# EasyEDA Pro project ProPrj_Buck_明月班_2025_2026-01-13.epro

# Schematic Schematic1
Board Name: Board1; Create Date: 2025-11-12; Page Name: P1; Project Name: Buck_明月班_2025; Schematic Name: Schematic1; Update Date: 2025-11-12; Company: 嘉立创EDA; Page Size: A3; Version: V1.0
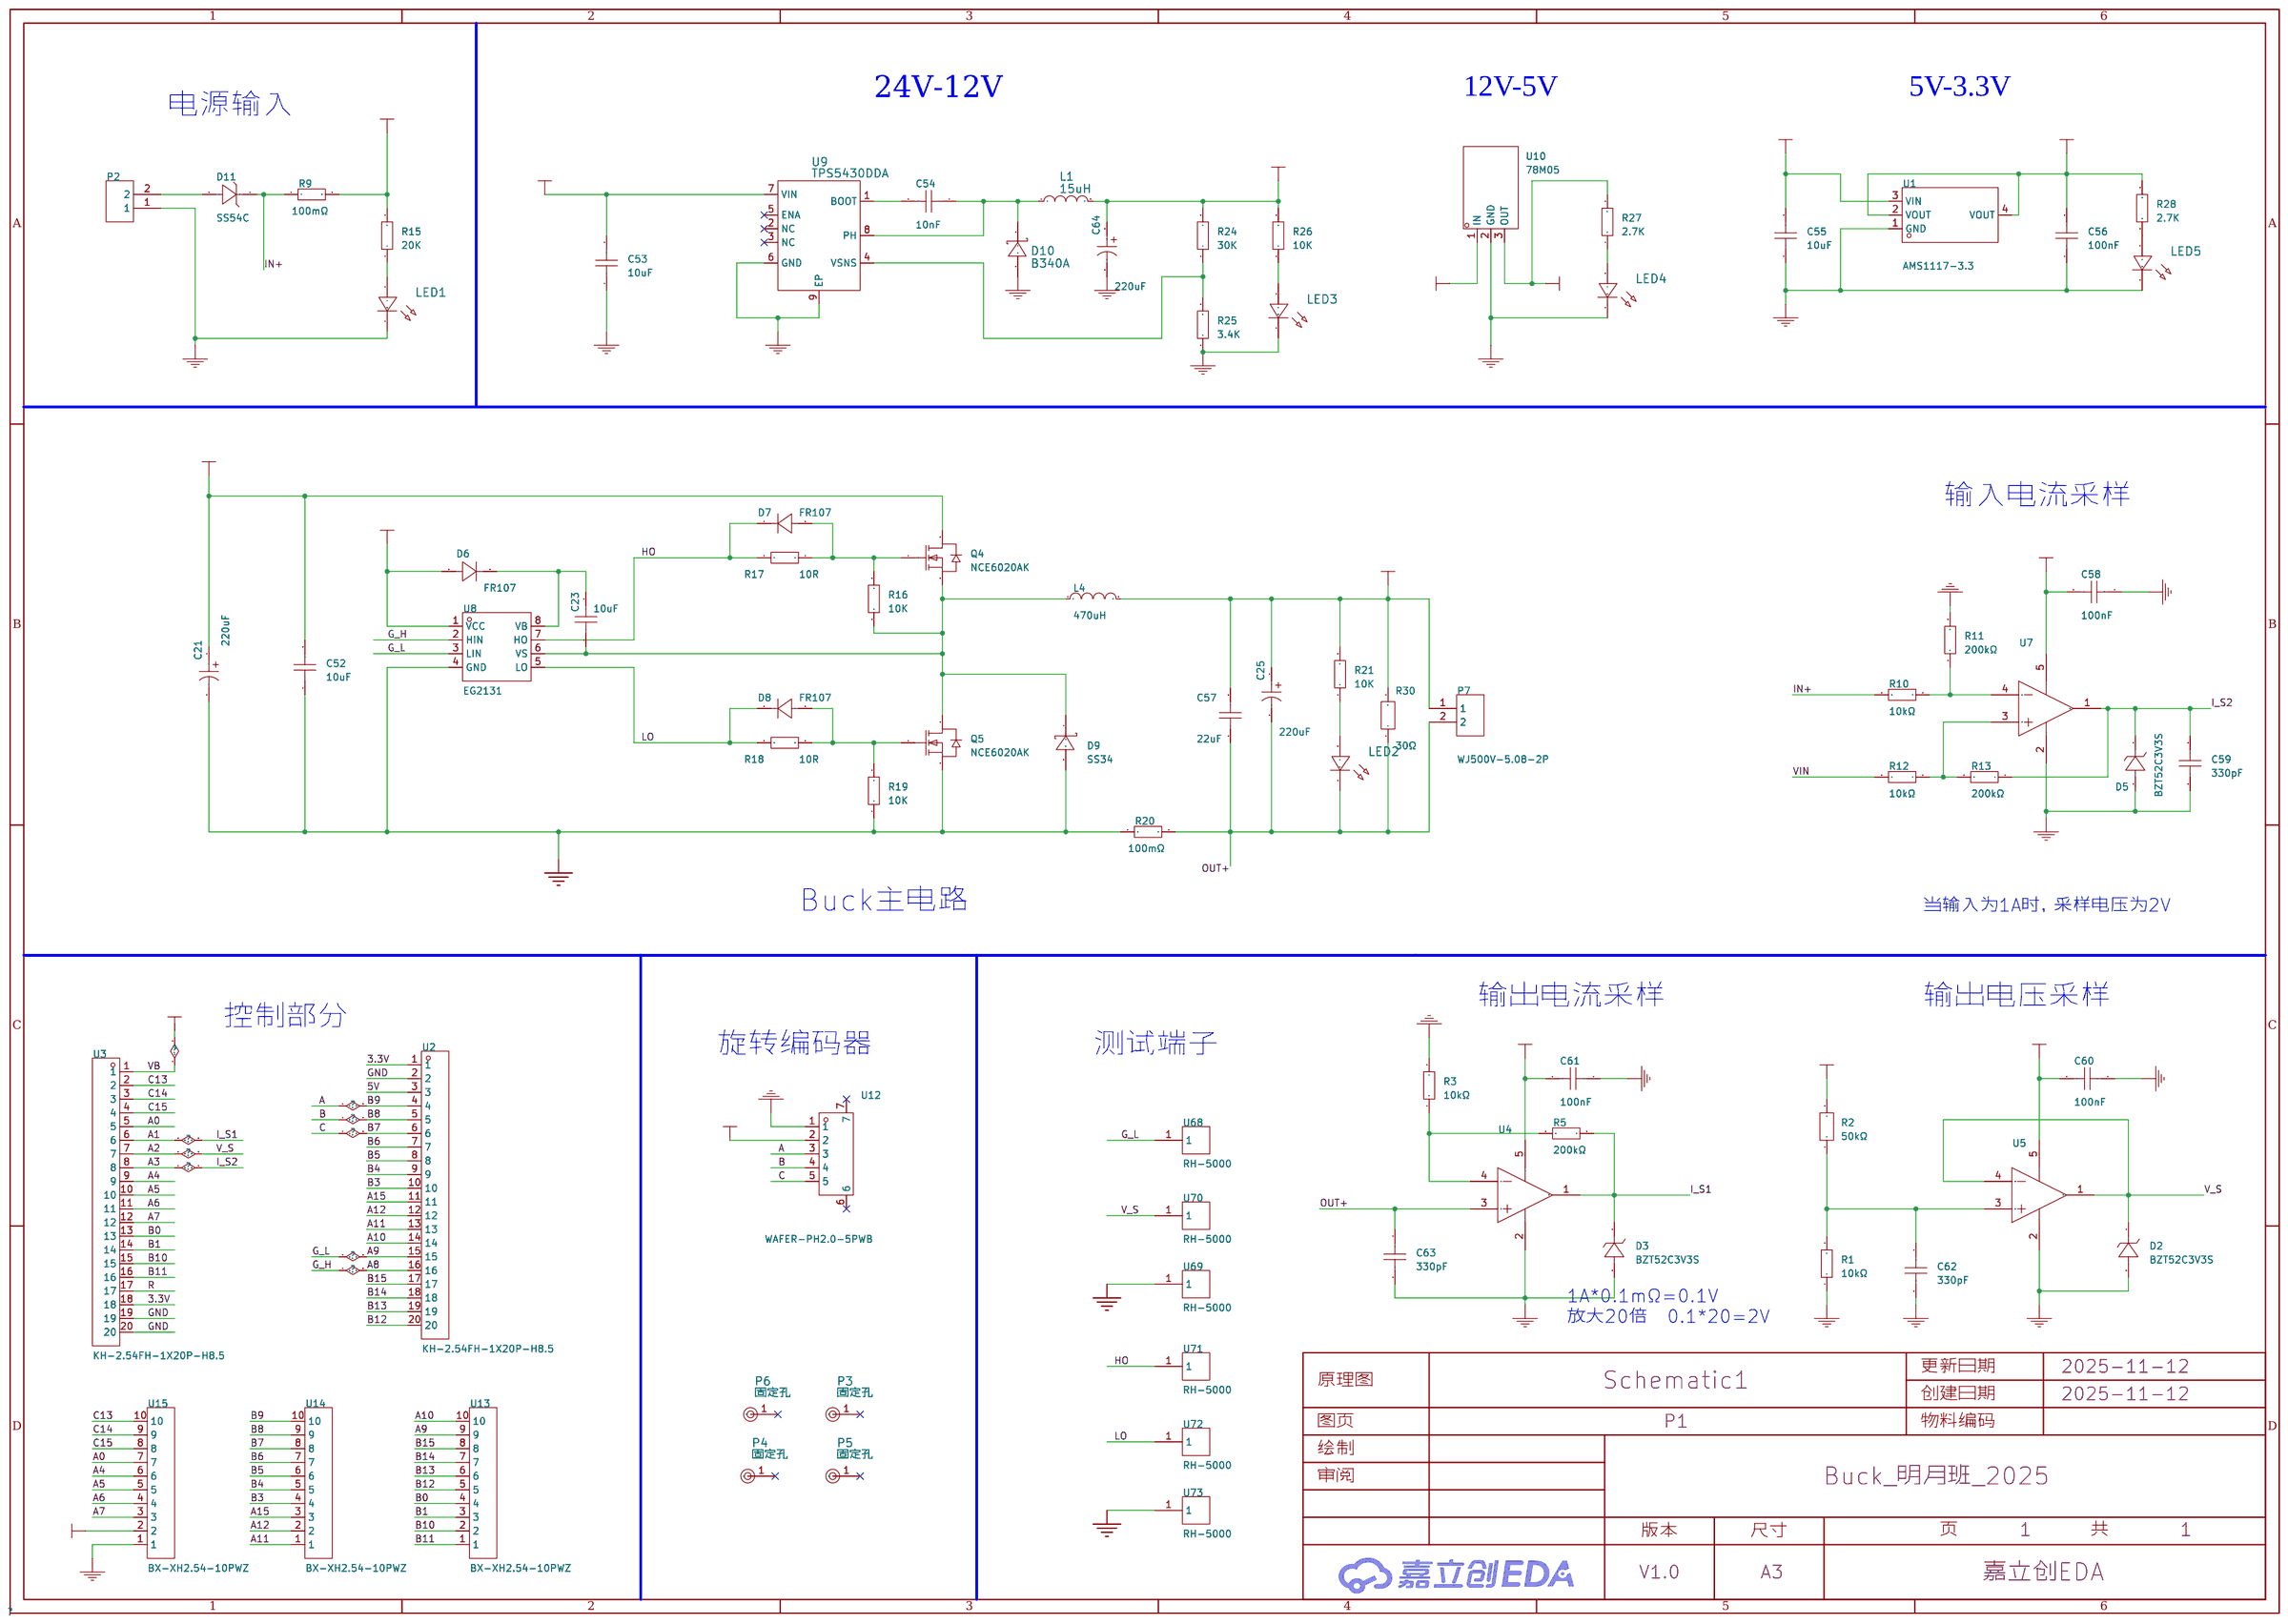
[diagram p0: schematic sheet]

## Parts
C21  220uF  [CAP-TH_BD8.0-P3.50-D0.6-FD]
C23  10uF  [C0805]
C25  220uF  [CAP-TH_BD8.0-P3.50-D0.6-FD]
C52  10uF  [C0805]
C53  10uF  [C0805]
C54  10nF  [C0805]
C55  10uF  [C0805]
C56  100nF  [C0805]
C57  22uF  [C0805]
C58  100nF  [C0805]
C59  330pF  [C0805]
C60  100nF  [C0805]
C61  100nF  [C0805]
C62  330pF  [C0805]
C63  330pF  [C0805]
C64  220uF  [CAP-TH_BD8.0-P3.50-D0.6-FD]
D2  BZT52C3V3S  [SOD-323_L1.7-W1.3-LS2.6-RD]
D3  BZT52C3V3S  [SOD-323_L1.7-W1.3-LS2.6-RD]
D5  BZT52C3V3S  [SOD-323_L1.7-W1.3-LS2.6-RD]
D6  FR107  [SMA_L4.2-W2.7-LS5.3-RD]
D7  FR107  [SMA_L4.2-W2.7-LS5.3-RD]
D8  FR107  [SMA_L4.2-W2.7-LS5.3-RD]
D9  SS34  [SMA_L4.3-W2.6-LS5.2-RD]
D10  B340A  [SMA_L4.3-W2.6-LS5.1-RD]
D11  SS54C  [SMC_L6.9-W5.9-LS7.9-RD]
L1  15uH  [IND-SMD_L7.5-W6.6]
L4  470uH  [IND-SMD_L12.3-W12.3_SMDRI127]
LED1  -  [LED_0805]
LED2  -  [LED_0805]
LED3  -  [LED_0805]
LED4  -  [LED_0805]
LED5  -  [LED_0805]
P2  WJ500V-5.08-2P  [conn-th_2p-p5.00_wj500v-5.08-2p]
P3  固定孔  [固定孔]
P4  固定孔  [固定孔]
P5  固定孔  [固定孔]
P6  固定孔  [固定孔]
P7  WJ500V-5.08-2P  [conn-th_2p-p5.00_wj500v-5.08-2p]
Q4  NCE6020AK  [TO-252-2_L6.6-W6.1-P4.57-LS10.1-TL-CW]
Q5  NCE6020AK  [TO-252-2_L6.6-W6.1-P4.57-LS10.1-TL-CW]
R1  10kΩ  [R0805]
R2  50kΩ  [R0805]
R3  10kΩ  [R0805]
R5  200kΩ  [R0805]
R9  100mΩ  [R1210]
R10  10kΩ  [R0805]
R11  200kΩ  [R0805]
R12  10kΩ  [R0805]
R13  200kΩ  [R0805]
R15  20K  [R0805]
R16  10K  [R0805]
R17  10R  [R0805]
R18  10R  [R0805]
R19  10K  [R0805]
R20  100mΩ  [R1210]
R21  10K  [R0805]
R24  30K  [R0805]
R25  3.4K  [R0805]
R26  10K  [R0805]
R27  2.7K  [R0805]
R28  2.7K  [R0805]
R30  30Ω  [R2512]
U1  AMS1117-3.3  [SOT-223-3_L6.5-W3.4-P2.30-LS7.0-BR]
U2  KH-2.54FH-1X20P-H8.5  [HDR-TH_20P-P2.54-V-F-2]
U3  KH-2.54FH-1X20P-H8.5  [HDR-TH_20P-P2.54-V-F-2]
U4  TLV333IDBVR  [SOT-23-5_L2.9-W1.6-P0.95-LS2.8-BL]
U5  TLV333IDBVR  [SOT-23-5_L2.9-W1.6-P0.95-LS2.8-BL]
U7  TLV333IDBVR  [SOT-23-5_L2.9-W1.6-P0.95-LS2.8-BL]
U8  EG2131  [SOP-8_L4.9-W3.9-P1.27-LS6.0-BL]
U9  TPS5430DDA  [ESOP-8_L4.9-W3.9-P1.27-LS6.0-BL-EP-2]
U10  78M05  [TO-252-2_L6.6-W6.1-P4.57-LS9.9-BR-CW]
U12  WAFER-PH2.0-5PWB  [CONN-SMD_5P-P2.00_XUNPU_WAFER-PH2.0-5PWB]
U13  BX-XH2.54-10PWZ  [CONN-TH_10P-P2.50_BX-XH2.54-10PWZ]
U14  BX-XH2.54-10PWZ  [CONN-TH_10P-P2.50_BX-XH2.54-10PWZ]
U15  BX-XH2.54-10PWZ  [CONN-TH_10P-P2.50_BX-XH2.54-10PWZ]
U68  RH-5000  [TEST-TH_BD2.54-P1.4_RED]
U69  RH-5000  [TEST-TH_BD2.54-P1.4_RED]
U70  RH-5000  [TEST-TH_BD2.54-P1.4_RED]
U71  RH-5000  [TEST-TH_BD2.54-P1.4_RED]
U72  RH-5000  [TEST-TH_BD2.54-P1.4_RED]
U73  RH-5000  [TEST-TH_BD2.54-P1.4_RED]

## Library data of the parts
C21 C25 C64 = 01EC3470: 容值:220uF;精度:±20%;额定电压:50V;纹波电流:350mA@120kHz;等效串联电阻:-;; LCSC Part Name: 220uF ±20% 50V; Supplier Part: C2836445; Manufacturer: KNSCHA(科尼盛); Supplier Footprint: 插件,D8xL12mm; JLCPCB Part Class: 扩展库; Datasheet: https://atta.szlcsc.com/upload/public/pdf/source/20210528/C2836445_4EB3DEC3C45633977FB5495C9B2E1697.pdf; Supplier: LCSC; Tolerance: ±20%; Rated Voltage: 50V; Ripple Current: 350mA@120kHz; Lead Spacing: 3.5mm; φD: 8mm; L: 12mm; Lifetime @ Temp: 2000hrs@105℃; Operating Temperature: -40℃~+105℃
C23 C52-C63 = CAP_0805: Supplier Footprint: 0805
D2 D3 D5 = BZT52C3V3S_C19077437: 二极管配置:独立式;稳压值(标称值):3.3V;稳压值(范围):3.1V~3.5V;功率(Pd):200mW;; Supplier Part: C19077437; Manufacturer: 宏迦橙; Supplier Footprint: SOD-323; JLCPCB Part Class: 扩展库; Datasheet: https://atta.szlcsc.com/upload/public/pdf/source/20231117/06CD1C2A69B3FFC97FEAE4263E1B2FE9.pdf; Supplier: LCSC; Diode Configuration: 独立式; Zener Voltage (Nom): 3.3V; Reverse Leakage Current (Ir): 5uA@1V; Zener Voltage (Range): 3.1V~3.5V; Power Dissipation: 200mW; Zener Impedance (Zzt): 95Ω
D6-D8 = FR107_C2892324: 二极管配置:1个独立式;正向压降(Vf):1.3V@1A;直流反向耐压(Vr):1kV;整流电流:1A;反向恢复时间(Trr):500ns;; LCSC Part Name: 耐压:1kV 电流:1A 反向恢复时间：500ns; Supplier Part: C2892324; Manufacturer: YONGYUTAI(永裕泰); Supplier Footprint: SMA; JLCPCB Part Class: 扩展库; Datasheet: https://item.szlcsc.com/datasheet/FR107/3124344.html; Supplier: LCSC; Diode Configuration: 1个独立式; Voltage - Forward(Vf@If): 1.3V@1A; Voltage - DC Reverse(Vr): 1kV; Current - Rectified: 1A; Reverse Leakage Current (Ir): 5uA@1kV; Reverse Recovery Time (trr): 500ns; Operating Junction Temperature Range: -55℃~+150℃; Non-Repetitive Peak Forward Surge Current: 30A
D9 = SS34_C8678: 二极管配置:独立式;正向压降(Vf):550mV@3A;直流反向耐压(Vr):40V;整流电流:3A;; LCSC Part Name: 电压:40V 电流:3A; Supplier Part: C8678; Manufacturer: MDD(辰达半导体); Supplier Footprint: SMA(DO-214AC); JLCPCB Part Class: 基础库; Datasheet: https://atta.szlcsc.com/upload/public/pdf/source/20230314/A80AE34493C69B89E2F4B1712F433538.pdf; Supplier: LCSC; Diode Configuration: 独立式; Forward Voltage (Vf@If): 550mV@3A; Reverse Voltage (Vr): 40V; Rectified Current: 3A; Reverse Leakage Current (Ir): 500uA@40V
D10 = B340A: Supplier: LCSC; Manufacturer: MDD; Supplier Part: C64982; JLCPCB Part Class: ExtendedPart
D11 = SS54C_C18199188: 二极管配置:独立式;正向压降(Vf):680mV@5A;直流反向耐压(Vr):40V;整流电流:5A;; LCSC Part Name: 电压:40V 电流:5A; Supplier Part: C18199188; Manufacturer: R+O(宏嘉诚); Supplier Footprint: SMC; JLCPCB Part Class: 扩展库; Datasheet: https://item.szlcsc.com/datasheet/SS54C/19354420.html; Supplier: LCSC; Diode Configuration: 独立式; Voltage - Forward(Vf@If): 680mV@5A; Voltage - DC Reverse(Vr): 40V; Current - Rectified: 5A; Reverse Leakage Current (Ir): 150uA@40V; Operating Junction Temperature Range: -55℃~+125℃; Non-Repetitive Peak Forward Surge Current: 120A
L1 = CKST0605-15uH/M: Supplier: LCSC; Supplier Part: C3002651; Manufacturer: CENKER(岑科); JLCPCB Part Class: ExtendedPart
L4 = SMDRI127-471MT: 电感值:470uH;精度:±20%;额定电流:-;饱和电流(Isat):1.5A;类型:屏蔽电感;; LCSC Part Name: 470uH ±20% 1.5A; Supplier Part: C10153; Manufacturer: SXN(顺翔诺); Supplier Footprint: SMD,12.3x12.3mm; JLCPCB Part Class: 扩展库; Datasheet: https://atta.szlcsc.com/upload/public/pdf/source/20210810/6F96FDC19AA308DD2AD166FFB9640E87.pdf; Supplier: LCSC; Tolerance: ±20%; Saturation Current (Isat): 1.5A; DC Resistance (DCR): 980mΩ; Type: 屏蔽电感
LED1-LED5 = LED_0805-R: Supplier Footprint: 0805
P2 P7 = WJ500V-5.08-2P: 结构:1x2P;间距:5.08mm;颜色:绿色;安装方式:直插;额定电流:18A;额定电压:250V;排数:1;线规 - AWG:14~30;线规 - 平方毫米:2.5;每排PIN数:2;触头材质:-;触头镀层:-;工作温度范围:-40℃~+105℃;焊接温度(最大值):-;; LCSC Part Name: 1x2P 5.08mm 直插 排数:1 每排P数:2; Supplier Part: C8465; Manufacturer: KANGNEX(康奈克斯电气); Supplier Footprint: 插件,P=5.08mm; JLCPCB Part Class: 扩展库; Datasheet: https://atta.szlcsc.com/upload/public/pdf/source/20191225/C8465_02D34CE5B5B4A53DF5891601D97FA9F4.pdf; Supplier: LCSC; Structure: 1x2P; Pitch: 5.08mm; Color: 绿色; Mounting Style: 直插; Current Rating (Max): 18A; Voltage Rating (Max): 250V; Number of Pins: 2P; Number of Rows: 1; Wire Gauge - AWG: 14~30; Wire Gauge - mm2: 2.5; Number of PINs Per Row: 2; Operating Temperature Range: -40℃~+105℃; Screw Specification: M2.5
P3-P6 = 固定孔
Q4 Q5 = NCE6020AK: 数量:1个N沟道;漏源电压(Vdss):60V;连续漏极电流(Id):20A;导通电阻(RDS(on)):40mΩ@4.5V,10A;耗散功率(Pd):45W;阈值电压(Vgs(th)):2.5V@250uA;; LCSC Part Name: 1个N沟道 耐压:60V 电流:20A; Supplier Part: C108639; Manufacturer: NCE(无锡新洁能); Supplier Footprint: TO-252-2L; JLCPCB Part Class: 扩展库; Datasheet: https://item.szlcsc.com/datasheet/NCE6020AK/109858.html; Supplier: LCSC; Number: 1个N沟道; Drain to Source Voltage: 60V; Current - Continuous Drain(Id): 20A; RDS(on): 40mΩ@4.5V,10A; Pd - Power Dissipation: 45W; Gate Threshold Voltage (Vgs(th)): 2.5V@250uA; Gate Charge(Qg): 25nC@10V; Operating Temperature: -55℃~+175℃; Type: N沟道
R1 R3 R10 R12 = 0603WAF1002T5E: 电阻类型:厚膜电阻;阻值:10kΩ;精度:±1%;功率:100mW;最大工作电压:75V;温度系数:±100ppm/℃;; LCSC Part Name: 厚膜电阻 10kΩ ±1% 100mW; Supplier Part: C25804; Manufacturer: UNI-ROYAL(厚声); Supplier Footprint: 0603; JLCPCB Part Class: 基础库; Datasheet: https://atta.szlcsc.com/upload/public/pdf/source/20200306/C422600_1E6D84923E4A46A82E41ADD87F860B5C.pdf; Supplier: LCSC; Type: 厚膜电阻; Tolerance: ±1%; Power(Watts): 100mW; Overload Voltage (Max): 75V; Temperature Coefficient: ±100ppm/℃; Operating Temperature Range: -55℃~+155℃
R2 = RT0603BRD0750KL: 电阻类型:薄膜电阻;阻值:50kΩ;精度:±0.1%;功率:100mW;最大工作电压:-;温度系数:±25ppm/℃;; LCSC Part Name: 薄膜电阻 50kΩ ±0.1% 100mW; Supplier Part: C861451; Manufacturer: YAGEO(国巨); Supplier Footprint: 0603; JLCPCB Part Class: 扩展库; Datasheet: https://atta.szlcsc.com/upload/public/pdf/source/20200610/C326738_5639A9F1B6EB6E4AE2197577D3456E7F.pdf; Supplier: LCSC; Type: 薄膜电阻; Tolerance: ±0.1%; Power(Watts): 100mW; Temperature Coefficient: ±25ppm/℃; Operating Temperature Range: -55℃~+155℃
R5 R11 R13 = 0603WAF2003T5E: 电阻类型:厚膜电阻;阻值:200kΩ;精度:±1%;功率:100mW;最大工作电压:75V;温度系数:±100ppm/℃;; LCSC Part Name: 200kΩ ±1% 100mW 厚膜电阻; Supplier Part: C25811; Manufacturer: UNI-ROYAL(厚声); Supplier Footprint: 0603; JLCPCB Part Class: 基础库; Datasheet: https://atta.szlcsc.com/upload/public/pdf/source/20200306/C422600_1E6D84923E4A46A82E41ADD87F860B5C.pdf; Supplier: LCSC; Type: 厚膜电阻; Tolerance: ±1%; Power(Watts): 100mW; Overload Voltage (Max): 75V; Temperature Coefficient: ±100ppm/℃; Operating Temperature Range: -55℃~+155℃
R9 R20 = 1210W2F100LT5E: 电阻类型:厚膜电阻;阻值:100mΩ;精度:±1%;功率:500mW;最大工作电压:200V;温度系数:±800ppm/℃;; LCSC Part Name: 100mΩ ±1% 500mW 厚膜电阻; Supplier Part: C270892; Manufacturer: UNI-ROYAL(厚声); Supplier Footprint: 1210; JLCPCB Part Class: 扩展库; Datasheet: https://atta.szlcsc.com/upload/public/pdf/source/20200306/C422600_1E6D84923E4A46A82E41ADD87F860B5C.pdf; Supplier: LCSC; Type: 厚膜电阻; Tolerance: ±1%; Power(Watts): 500mW; Overload Voltage (Max): 200V; Temperature Coefficient: ±800ppm/℃; Operating Temperature Range: -55℃~+155℃
R15-R19 R24-R28 = Res_0805: Supplier Footprint: 0805
R21 = 0603WAF1003T5E: 电阻类型:厚膜电阻;阻值:100kΩ;精度:±1%;功率:100mW;最大工作电压:75V;温度系数:±100ppm/℃;; LCSC Part Name: 100kΩ ±1% 100mW 厚膜电阻; Supplier Part: C25803; Manufacturer: UNI-ROYAL(厚声); Supplier Footprint: 0603; JLCPCB Part Class: Basic Part; Datasheet: https://atta.szlcsc.com/upload/public/pdf/source/20200306/C422600_1E6D84923E4A46A82E41ADD87F860B5C.pdf; Supplier: LCSC; Type: 厚膜电阻; Tolerance: ±1%; Power(Watts): 100mW; Overload Voltage (Max): 75V; Temperature Coefficient: ±100ppm/℃; Operating Temperature Range: -55℃~+155℃
R30 = FRP2512F1000TS: 电阻类型:厚膜电阻;阻值:100Ω;精度:±1%;功率:2W;工作电压:200V;温度系数:±200ppm/℃;; LCSC Part Name: 100Ω ±1% 2W 厚膜电阻; Supplier Part: C5126189; Manufacturer: FOJAN(富捷); Supplier Footprint: 2512; JLCPCB Part Class: 扩展库; Supplier: LCSC; Type: 厚膜电阻; Tolerance: ±1%; Power(Watts): 2W; Voltage-Supply(Max): 200V; Temperature Coefficient: ±200ppm/℃; Operating Temperature: -55℃~+155℃
U1 = AMS1117-3.3_C6186: 输出类型:固定;最大输入电压:-;输出电压:3.3V;最大输出电流:1A;电源纹波抑制比(PSRR):72dB@(120Hz);输出极性:正极;; LCSC Part Name: 输出3.3V 1A; Supplier Part: C6186; Manufacturer: AMS; Supplier Footprint: SOT-223; JLCPCB Part Class: 基础库; Datasheet: https://atta.szlcsc.com/upload/public/pdf/source/20180727/C6186_7A095716F0823C02F1997A905E26C086.pdf; Supplier: LCSC; Output Type: 固定; Output Voltage: 3.3V; MAX Output Current: 1A; Power Supply Rejection Ratio (PSRR): 72dB@(120Hz); Dropout Voltage: 1.3V@(800mA); Output Polarity: 正极; Number of Outputs: 1
U2 U3 = KH-2.54FH-1X20P-H8.5: 插孔结构:1x20P;间距:2.54mm;行距:-;圆孔/方孔:方孔;安装类型:直插;排数:单排;总孔位数:20P;额定电流:3A;额定电压:-;插孔方向:顶部;塑高:8.5mm;工作温度范围:-40℃~+105℃;; LCSC Part Name: 间距:2.54mm 1x20P 直插; Supplier Part: C2905423; Manufacturer: kinghelm(金航标); Supplier Footprint: 插件,P=2.54mm; JLCPCB Part Class: 扩展库; Datasheet: https://atta.szlcsc.com/upload/public/pdf/source/20211019/BDB673907948473CE61C8A1CF06C5BF5.pdf; Supplier: LCSC; Holes Structure: 1x20P; Pitch: 2.54mm; Circular Hole / Square Hole: 方孔; Mounting Type: 直插; Number of Rows: 单排; Number of Holes: 20P; Current Rating (Max): 3A; Holes Direction: 顶部; Insulation Height: 8.5mm; Operating Temperature Range: -40℃~+105℃
U4 U5 U7 = TLV333IDBVR: 放大器数:单路;增益带宽积(GBP):350kHz;输入偏置电流(Ib):70pA;输入失调电压(Vos):2uV;压摆率(SR):0.16V/us;轨到轨:-;; Supplier Part: C473369; Manufacturer: TI(德州仪器); Supplier Footprint: SOT-23-5; JLCPCB Part Class: 扩展库; Datasheet: https://www.ti.com/cn/lit/gpn/tlv333; Supplier: LCSC; Number of Circuits: 单路; Gain Bandwidth Product(GBP): 350kHz; Current - Input Bias(Ib): 70pA; Voltage - Input Offset(Vos): 2uV; Slew Rate(SR): 0.16V/us; Operating Temperature: -40℃~+125℃
U8 = EG2131_C5240691: 负载类型:MOSFET；IGBT;灌电流(IOL):1.5A;拉电流(IOH):1A;工作电压:11V~20V;上升时间(tr):180ns;下降时间(tf):70ns;; LCSC Part Name: 大功率MOS管、IGBT管栅极驱动芯片; Supplier Part: C5240691; Manufacturer: EG(屹晶微); Supplier Footprint: SOP-8-150mil; JLCPCB Part Class: 扩展库; Datasheet: https://item.szlcsc.com/datasheet/EG2131/5945861.html; Supplier: LCSC; Load Type: MOSFET；IGBT; Current - Output Low(IOL): 1.5A; Current - Output High(IOH): 1A; Voltage - Supply: 11V~20V; Rise Time: 180ns; Fall Time: 70ns; Features: 欠压保护(UVP); Operating Temperature: -45℃~+125℃; Input Logic Level - Low: 0V~1V
U9 = TPS5430DDA: Supplier: LCSC; Supplier Part: C502477; Manufacturer: TI(德州仪器); JLCPCB Part Class: ExtendedPart
U10 = 78M05_C347278: 输出类型:固定;工作电压:35V;输出电压:5V;输出电流:1A;电源纹波抑制比(PSRR):80dB@(120Hz);输出极性:正极;; LCSC Part Name: 输入35V 输出5V; Supplier Part: C347278; Manufacturer: UMW(友台半导体); Supplier Footprint: TO-252; JLCPCB Part Class: 扩展库; Datasheet: https://item.szlcsc.com/datasheet/78M05/323938.html; Supplier: LCSC; Output Type: 固定; Voltage - Supply: 35V; Output Voltage: 5V; Output Current: 1A; Power Supply Rejection Ratio (PSRR): 80dB@(120Hz); Voltage Dropout: 2V@(500mA); standby current: 6mA; Noise: 40uV; Features: 短路保护；过热保护; Operating Temperature: -20℃~+85℃; Output Configuration: 正极; Number of Outputs: 1
U12 = WAFER-PH2.0-5PWB: 插针结构:1x5P;间距:2mm;安装方式:卧贴;参考系列:PH;总PIN数:5P;排数:1;每排PIN数:5;行距:-;额定电流:2A;触头材质:黄铜;触头镀层:锡;工作温度:-25℃~+85℃;; LCSC Part Name: 1x5P 间距:2mm 卧贴 系列:PH; Supplier Part: C3029443; Manufacturer: XUNPU(讯普); Supplier Footprint: SMD,P=2mm,卧贴; JLCPCB Part Class: 扩展库; Datasheet: https://item.szlcsc.com/datasheet/WAFER-PH2.0-5PWB/3561455.html; Supplier: LCSC; Pins Structure: 1x5P; Pitch: 2mm; Mounting Type: 卧贴; Reference Series: PH; Number of Pins: 5P; Number of Rows: 1; Number of PINs Per Row: 5; Current Rating: 2A; Contact Material: 黄铜; Contact Plating: 锡; Operating Temperature: -25℃~+85℃; Voltage Rating: 250V; Plastic Material: LCP; Supplementary Features: 辅助焊脚; Color: 米色; Z-Height of the Board: 5.6mm; X-Length of Bottom Edge on Board (Spacing Line): 14mm; Y-Width of Bottom Edge on Board: 7.59mm
U13-U15 = BX-XH2.54-10PWZ: 插针结构:1x10P;间距:2.5mm;安装方式:弯插;参考系列:XH;总PIN数:10P;排数:1;每排PIN数:10;行距:-;额定电流:3A;触头材质:黄铜;触头镀层:锡;工作温度:-25℃~+85℃;; LCSC Part Name: 1x10P 间距:2.5mm 弯插 系列:XH; Supplier Part: C18077850; Manufacturer: Bossie(博锡); Supplier Footprint: 弯插,P=2.54mm; JLCPCB Part Class: 扩展库; Datasheet: https://item.szlcsc.com/datasheet/BX-XH2.54-10PWZ/19218251.html; Supplier: LCSC; Pins Structure: 1x10P; Pitch: 2.5mm; Mounting Type: 弯插; Reference Series: XH; Number of Pins: 10P; Number of Rows: 1; Number of PINs Per Row: 10; Current Rating: 3A; Contact Material: 黄铜; Contact Plating: 锡; Operating Temperature: -25℃~+85℃; Voltage Rating: 250V; Plastic Material: PA66; Flame Retardant Rating: UL94V-0; Color: 白色; Z-Height of the Board: 5.9mm; X-Length of Bottom Edge on Board (Spacing Line): 27.5mm; Y-Width of Bottom Edge on Board: 7.32mm
U68-U73 = RH-5000: LCSC Part Name: PCB电路板测试点/测试针; Supplier Part: C5277086; Manufacturer: 荣和; JLCPCB Part Class: 扩展库; Datasheet: https://atta.szlcsc.com/upload/public/pdf/source/20230704/1671C2774A3D6CEDC1FD6AAF48538C87.pdf; Supplier: LCSC

## Nets
3.3V: C56.2 C58.2 C60.2 C61.2 R28.2 U1.2(VOUT) U1.4(VOUT) U2.1 U3.1 U3.18 U4.5(V+) U5.5(V+) U7.5(V+)
5V: C55.2 R27.2 U1.3(VIN) U2.3 U10.3(OUT) U12.2 U15.2
12V: C64.1 D6.2(A) L1.2 R24.2 R26.2 U8.1(VCC) U10.1(IN)
GND: C21.2 C52.1 C53.1 C55.1 C56.1 C58.1 C59.2 C60.1 C61.1 C62.2 C63.2 C64.2 D2.2(A) D3.2(A) D5.2(A) D9.2(A) D10.2(A) LED1.1(C) LED3.1(C) LED4.1(C) LED5.1(C) P2.1 Q5.3(S) R1.1 R3.2 R11.2 R19.1 R20.1 R25.1 U1.1(GND) U2.2 U3.19 U3.20 U4.2(V-) U5.2(V-) U7.2(V-) U8.4(GND) U9.6(GND) U9.9(EP) U10.2(GND) U12.1 U15.1 U69.1 U73.1
VIN: C21.1 C52.2 C53.2 Q4.2(D) R9.2 R12.2 R15.2 U9.7(VIN)
A: U2.4 U12.3 U14.10
A0: U3.5 U15.7
A1: D3.1(K) R5.1 U3.6 U4.1(OUT)
A2: D2.1(K) U3.7 U5.1(OUT) U5.4(IN-) U70.1
A3: C59.1 D5.1(K) R13.1 U3.8 U7.1(OUT)
A4: U3.9 U15.6
A5: U3.10 U15.5
A6: U3.11 U15.4
A7: U3.12 U15.3
A8: U2.16 U8.2(HIN)
A9: U2.15 U8.3(LIN) U13.9 U68.1
A10: U2.14 U13.10
A11: U2.13 U14.1
A12: U2.12 U14.2
A15: U2.11 U14.3
B: U2.5 U12.4 U14.9
B0: U3.13 U13.4
B1: U3.14 U13.3
B3: U2.10 U14.4
B4: U2.9 U14.5
B5: U2.8 U14.6
B6: U2.7 U14.7
B7: U2.6 U12.5 U14.8
B10: U3.15 U13.2
B11: U3.16 U13.1
B12: U2.20 U13.5
B13: U2.19 U13.6
B14: U2.18 U13.7
B15: U2.17 U13.8
C13: U3.2 U15.10
C14: U3.3 U15.9
C15: U3.4 U15.8
HO: D7.1(K) R17.2 U8.7(HO) U71.1
IN+: D11.1(K) R9.1 R10.2
LO: D8.1(K) R18.2 U8.5(LO) U72.1
OUT+: C25.2 C57.1 C63.1 LED2.1(C) P7.2 R20.2 R30.1 U4.3(IN+)
R: U3.17
VOUT: C25.1 C57.2 L4.2 P7.1 R2.2 R21.2 R30.2
$1N156: D11.2(A) P2.2
$1N2005: C62.1 R1.2 R2.1 U5.3(IN+)
$1N2404: R3.1 R5.2 U4.4(IN-)
$1N6608: R12.1 R13.2 U7.3(IN+)
$1N6687: R10.1 R11.1 U7.4(IN-)
$1N12639: C23.1 D9.1(K) L4.1 Q4.3(S) Q5.2(D) R16.1 U8.6(VS)
$1N13184: C23.2 D6.1(K) U8.8(VB)
$1N13307: D7.2(A) Q4.1(G) R16.2 R17.1
$1N13478: D8.2(A) Q5.1(G) R18.1 R19.2
$1N14214: LED2.2(A) R21.1
$1N14615: C54.2 U9.1(BOOT)
$1N14616: C54.1 D10.1(K) L1.1 U9.8(PH)
$1N15322: LED1.2(A) R15.1
$1N15362: R24.1 R25.2 U9.4(VSNS)
$1N15623: LED3.2(A) R26.1
$1N15689: LED4.2(A) R27.1
$1N15785: LED5.2(A) R28.1

Not connected (* = marked no-connect by the designer): P3 1(3mm洞)*; P4 1(3mm洞)*; P5 1(3mm洞)*; P6 1(3mm洞)*; U9 2(NC)* 3(NC)* 5(ENA)*; U12 6* 7*

## Notes on the sheet
- 24V-12V
- 12V-5V
- 5V-3.3V
- 电源输入
- 输入电流采样
- Buck主电路
- 当输入为1A时，采样电压为2V
- 输出电流采样
- 输出电压采样
- 控制部分
- 旋转编码器
- 测试端子
- 1A*0.1mΩ=0.1V
  放大20倍  0.1*20=2V

# Board PCB1
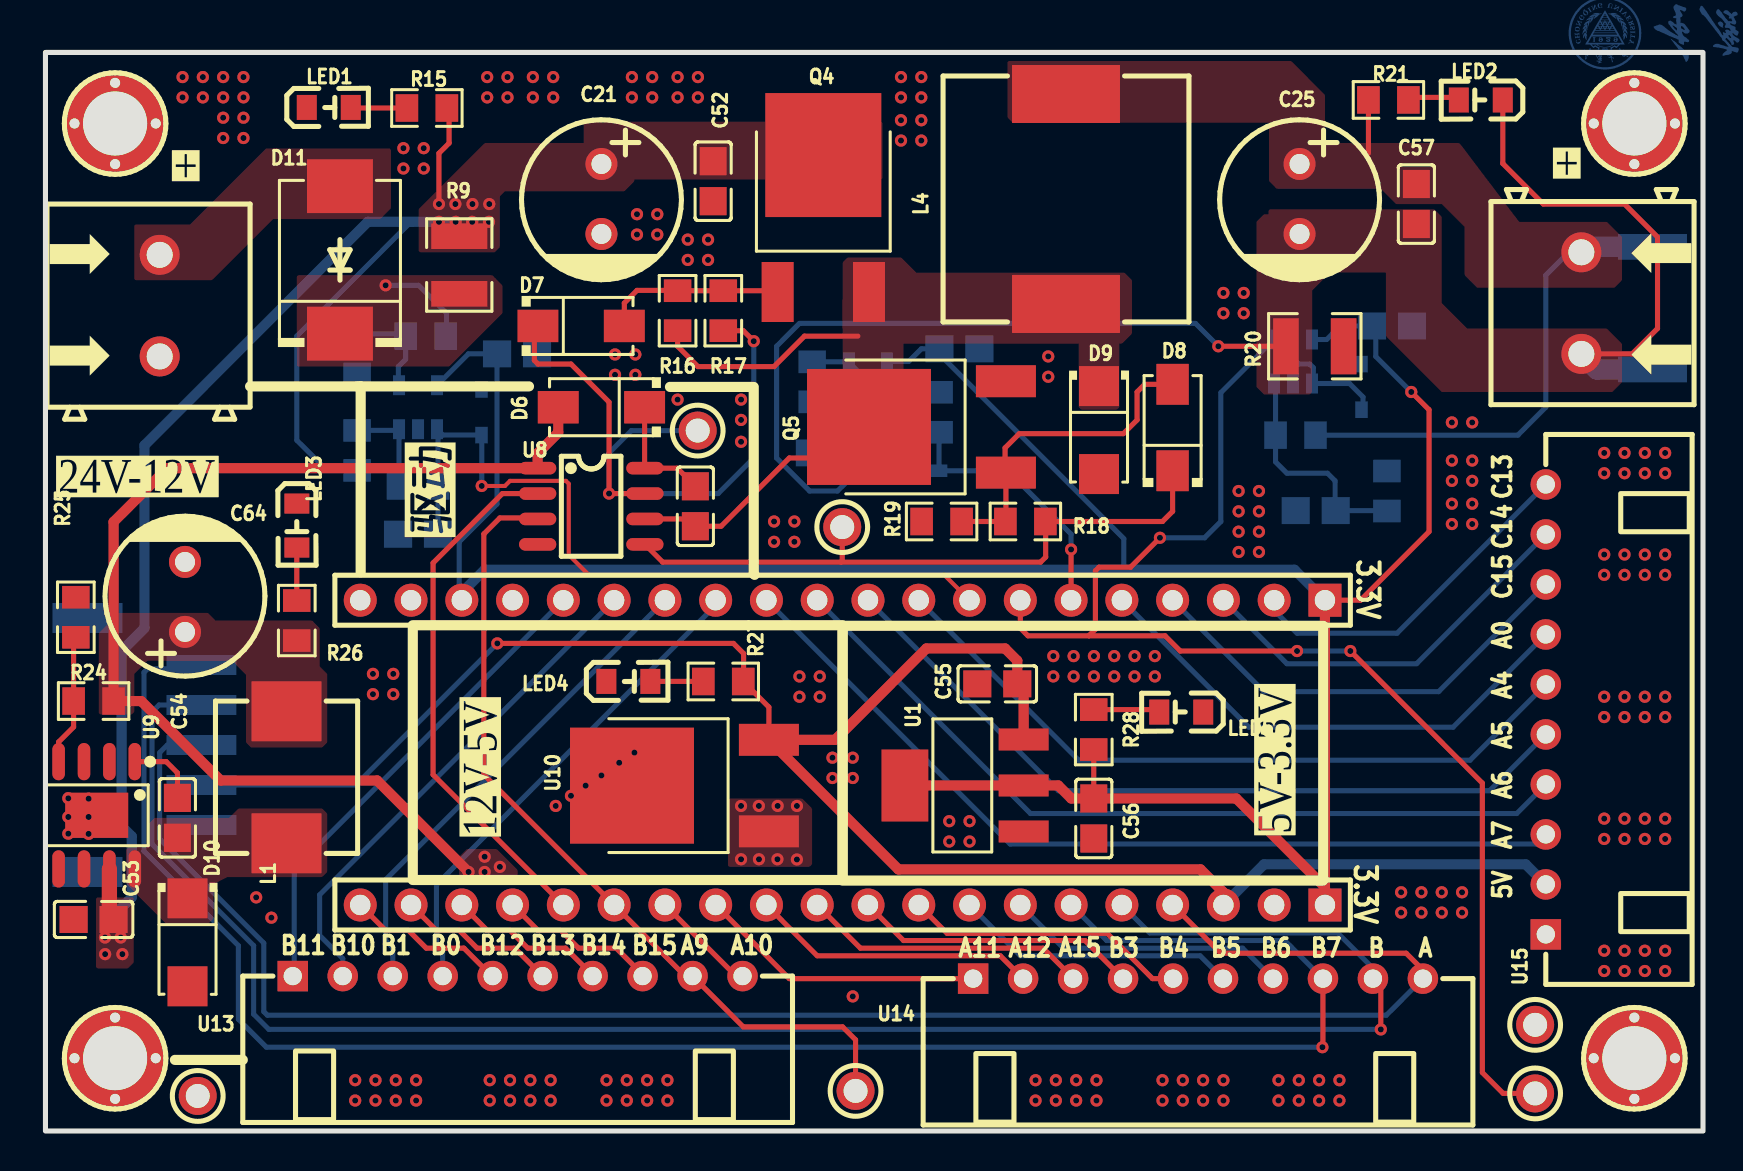
[diagram p1: board, top side]
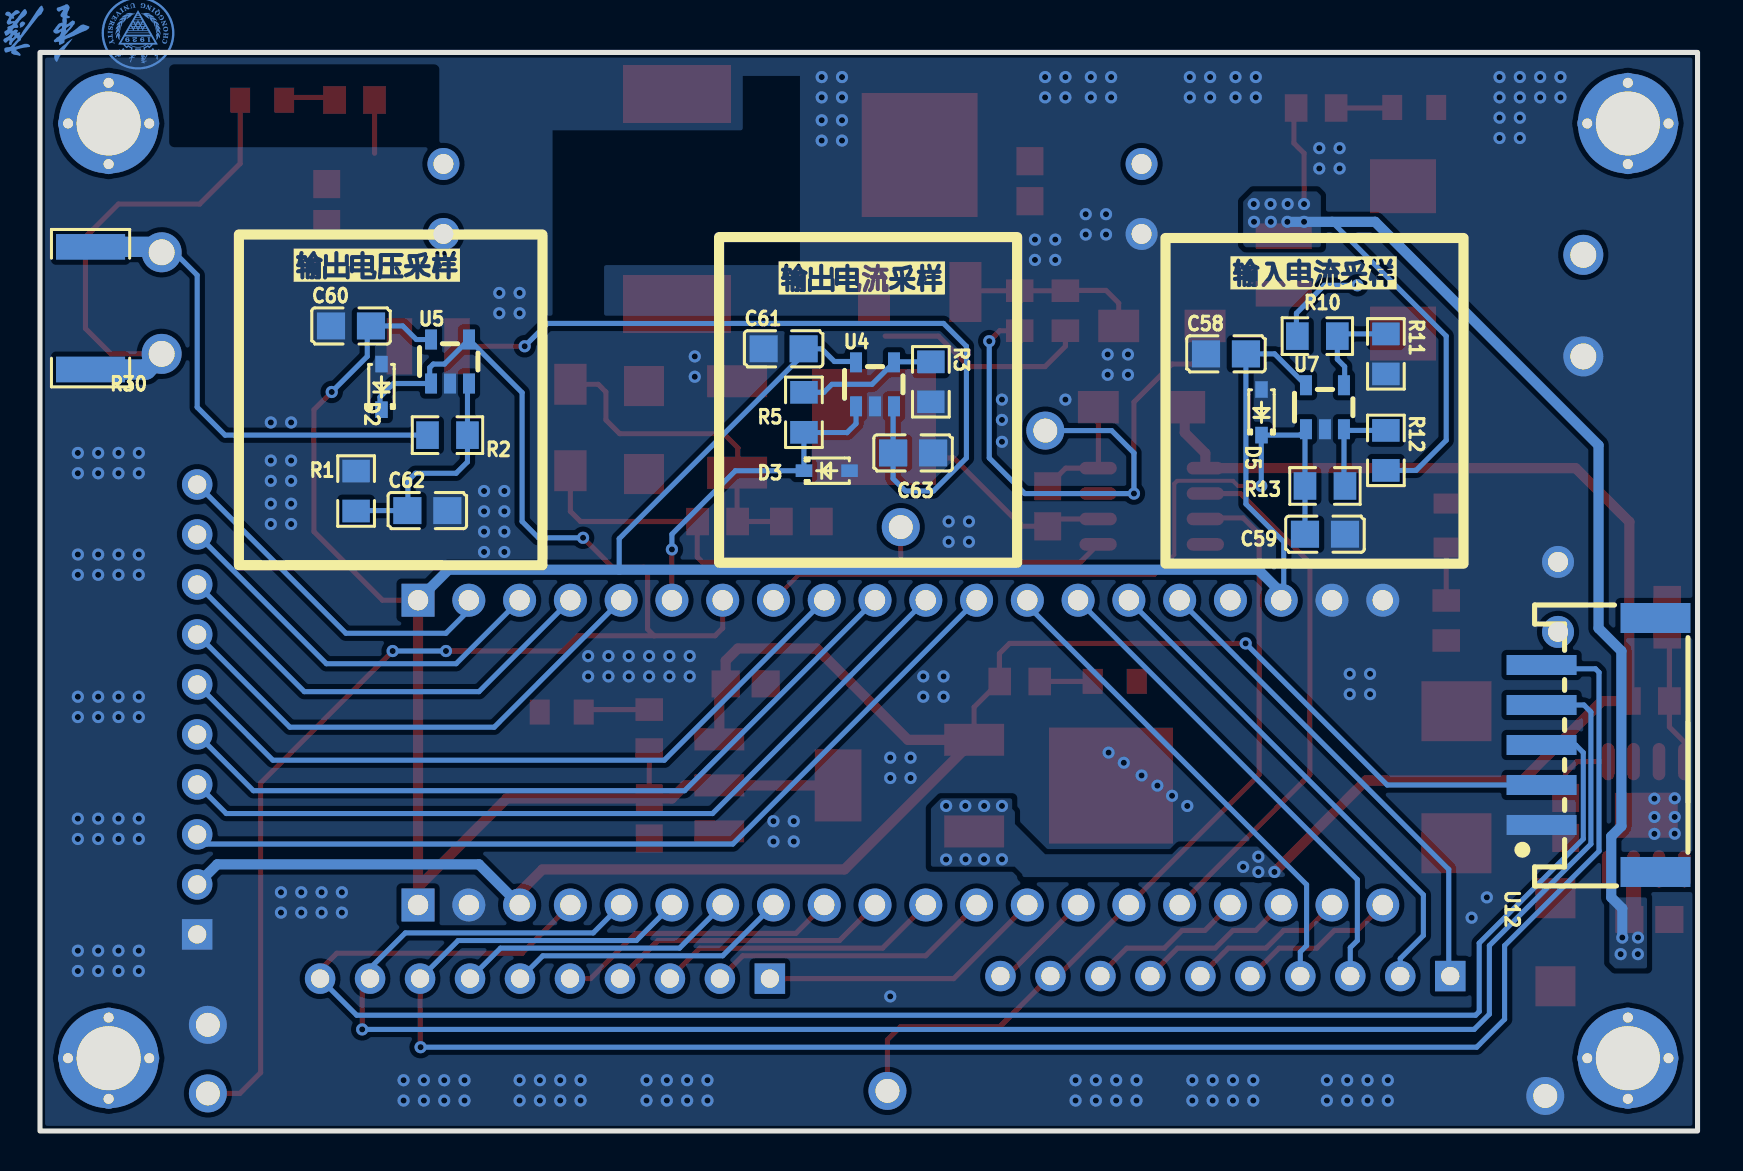
[diagram p2: board, bottom side, seen from below]

Outline 82.92 x 53.94 mm; copper layers: Top Layer, Bottom Layer. Coordinates in mm from the lower left corner of the outline.
Outline path: rectangle 0,53.94 82.92,0
Stack: Top Layer 0.035mm / Dielectric1 1.51mm FR4 er 4.5 / Bottom Layer 0.035mm

## Design rules (mm)
template: 自定义配置
spacing copperThickness1oz (default): track to track 0.102, other pairs 0.152 to 0.3
spacing copperThickness2oz: track to track 0.203, other pairs 0.152 to 0.3
track width copperThickness1oz (default): min 0.127, default 0.254, max 2.54
track width copperThickness2oz: min 0.203, default 0.254, max 2.54
differential pair differentialPair (default): width min 0.127, default 0.254, max 2.54; gap min 0.152, default 0.152
via viaSize (default): diameter min 0.5, default 0.61, max 10; hole min 0.3, default 0.305, max 6.3

## Placement (name value [footprint] x y rotation side)
C21  220uF  [CAP-TH_BD8.0-P3.50-D0.6-FD]  27.81 46.61 270 top
C23  10uF  [C0805]  32.51 31.24 90 top
C25  220uF  [CAP-TH_BD8.0-P3.50-D0.6-FD]  62.74 46.61 270 top
C52  10uF  [C0805]  33.4 47.5 90 top
C53  10uF  [C0805]  2.41 10.58 0 top
C54  10nF  [C0805]  6.6 15.66 90 top
C55  10uF  [C0805]  47.62 22.36 0 top
C56  100nF  [C0805]  52.44 15.63 90 top
C57  22uF  [C0805]  68.58 46.36 90 top
C58  100nF  [C0805]  23.59 38.86 180 bottom
C59  330pF  [C0805]  18.64 29.85 180 bottom
C60  100nF  [C0805]  67.36 40.26 180 bottom
C61  100nF  [C0805]  45.72 39.12 180 bottom
C62  330pF  [C0805]  63.54 31.03 180 bottom
C63  330pF  [C0805]  39.24 33.91 180 bottom
C64  220uF  [CAP-TH_BD8.0-P3.50-D0.6-FD]  6.98 26.71 90 top
D2  BZT52C3V3S  [SOD-323_L1.7-W1.3-LS2.6-RD]  65.84 37.21 90 bottom
D3  BZT52C3V3S  [SOD-323_L1.7-W1.3-LS2.6-RD]  43.56 33.02 180 bottom
D5  BZT52C3V3S  [SOD-323_L1.7-W1.3-LS2.6-RD]  21.81 35.94 90 bottom
D6  FR107  [SMA_L4.2-W2.7-LS5.3-RD]  27.81 36.2 180 top
D7  FR107  [SMA_L4.2-W2.7-LS5.3-RD]  26.8 40.26 0 top
D8  FR107  [SMA_L4.2-W2.7-LS5.3-RD]  56.39 35.18 90 top
D9  SS34  [SMA_L4.3-W2.6-LS5.2-RD]  52.7 35.05 270 top
D10  B340A  [SMA_L4.3-W2.6-LS5.1-RD]  7.11 9.44 270 top
D11  SS54C  [SMC_L6.9-W5.9-LS7.9-RD]  14.73 43.56 90 top
L1  15uH  [IND-SMD_L7.5-W6.6]  12.06 17.69 90 top
L4  470uH  [IND-SMD_L12.3-W12.3_SMDRI127]  51.05 46.61 90 top
LED1  -  [LED_0805]  14.22 51.18 0 top
LED2  -  [LED_0805]  71.76 51.56 180 top
LED3  -  [LED_0805]  12.57 30.23 270 top
LED4  -  [LED_0805]  29.21 22.48 0 top
LED5  -  [LED_0805]  56.77 20.96 180 top
P2  WJ500V-5.08-2P  [conn-th_2p-p5.00_wj500v-5.08-2p]  5.72 41.28 90 top
P3  -  [固定孔]  79.49 3.64 0 top
P4  -  [固定孔]  3.48 50.38 0 top
P5  -  [固定孔]  79.49 50.38 0 top
P6  -  [固定孔]  3.48 3.64 0 top
P7  WJ500V-5.08-2P  [conn-th_2p-p5.00_wj500v-5.08-2p]  76.83 41.4 270 top
Q4  NCE6020AK  [TO-252-2_L6.6-W6.1-P4.57-LS10.1-TL-CW]  38.91 45.38 90 top
Q5  NCE6020AK  [TO-252-2_L6.6-W6.1-P4.57-LS10.1-TL-CW]  44.62 35.21 180 top
R1  10kΩ  [R0805]  67.11 32 270 bottom
R2  50kΩ  [R0805]  62.54 34.8 0 bottom
R3  10kΩ  [R0805]  38.35 37.47 270 bottom
R5  200kΩ  [R0805]  44.7 35.94 90 bottom
R9  100mΩ  [R1210]  20.7 43.31 90 top
R10  10kΩ  [R0805]  19.02 39.75 0 bottom
R11  200kΩ  [R0805]  15.59 38.86 270 bottom
R12  10kΩ  [R0805]  15.59 34.04 270 bottom
R13  200kΩ  [R0805]  18.64 32.26 180 bottom
R15  20K  [R0805]  19.08 51.16 0 top
R16  10K  [R0805]  31.62 41.02 90 top
R17  10R  [R0805]  33.91 41.02 270 top
R18  10R  [R0805]  49.02 30.48 0 top
R19  10K  [R0805]  44.83 30.48 0 top
R20  100mΩ  [R1210]  63.5 39.24 180 top
R21  10K  [R0805]  67.18 51.56 180 top
R24  30K  [R0805]  2.41 21.5 0 top
R25  3.4K  [R0805]  1.52 25.69 270 top
R26  10K  [R0805]  12.57 25.53 270 top
R27  2.7K  [R0805]  33.91 22.48 0 top
R28  2.7K  [R0805]  52.44 20.07 270 top
R30  30Ω  [R2512]  80.39 41.15 90 bottom
U1  AMS1117-3.3  [SOT-223-3_L6.5-W3.4-P2.30-LS7.0-BR]  45.97 17.28 0 top
U2  KH-2.54FH-1X20P-H8.5  [HDR-TH_20P-P2.54-V-F-2]  39.88 11.3 180 top
U3  KH-2.54FH-1X20P-H8.5  [HDR-TH_20P-P2.54-V-F-2]  39.88 26.54 180 top
U4  TLV333IDBVR  [SOT-23-5_L2.9-W1.6-P0.95-LS2.8-BL]  41.15 37.34 180 bottom
U5  TLV333IDBVR  [SOT-23-5_L2.9-W1.6-P0.95-LS2.8-BL]  62.41 38.48 180 bottom
U7  TLV333IDBVR  [SOT-23-5_L2.9-W1.6-P0.95-LS2.8-BL]  18.64 36.2 180 bottom
U8  EG2131  [SOP-8_L4.9-W3.9-P1.27-LS6.0-BL]  27.3 31.24 270 top
U9  TPS5430DDA  [ESOP-8_L4.9-W3.9-P1.27-LS6.0-BL-EP-2]  2.56 15.79 180 top
U10  78M05  [TO-252-2_L6.6-W6.1-P4.57-LS9.9-BR-CW]  32.77 17.27 0 top
U12  WAFER-PH2.0-5PWB  [CONN-SMD_5P-P2.00_XUNPU_WAFER-PH2.0-5PWB]  4.95 19.3 90 bottom
U13  BX-XH2.54-10PWZ  [CONN-TH_10P-P2.50_BX-XH2.54-10PWZ]  23.62 7.75 0 top
U14  BX-XH2.54-10PWZ  [CONN-TH_10P-P2.50_BX-XH2.54-10PWZ]  57.66 7.62 0 top
U15  BX-XH2.54-10PWZ  [CONN-TH_10P-P2.50_BX-XH2.54-10PWZ]  75.06 21.08 90 top
U68  RH-5000  [TEST-TH_BD2.54-P1.4_RED]  40.53 2.01 90 top
U69  RH-5000  [TEST-TH_BD2.54-P1.4_RED]  7.62 1.75 90 top
U70  RH-5000  [TEST-TH_BD2.54-P1.4_RED]  74.52 1.88 90 top
U71  RH-5000  [TEST-TH_BD2.54-P1.4_RED]  32.63 35.03 90 top
U72  RH-5000  [TEST-TH_BD2.54-P1.4_RED]  39.86 30.2 90 top
U73  RH-5000  [TEST-TH_BD2.54-P1.4_RED]  74.52 5.31 90 top

## Footprints (pads in the part's own frame, mm; a bottom-side part is the same pattern mirrored in y, then rotated)
C0805
  rect 1.41x1.35 smd: 1(-1,0) 2(1,0)
CAP-TH_BD8.0-P3.50-D0.6-FD
  round 1.6 hole 1: 1(-1.75,0) 2(1.75,0)
CONN-SMD_5P-P2.00_XUNPU_WAFER-PH2.0-5PWB
  rect 1x3.5 smd: 1(-4,2.85) 2(-2,2.85) 3(0,2.85) 4(2,2.85) 5(4,2.85)
  rect 1.5x3.5 smd: 6(6.35,-2.85) 7(-6.35,-2.85)
conn-th_2p-p5.00_wj500v-5.08-2p
  round 2 hole 1.3: 1(-2.54,0) 2(2.54,0)
CONN-TH_10P-P2.50_BX-XH2.54-10PWZ
  rect 1.524x1.524 hole 0.914: 1(-11.25,0)
  round 1.524 hole 0.914: 2(-8.75,0) 3(-6.25,0) 4(-3.75,0) 5(-1.25,0) 6(1.25,0) 7(3.75,0) 8(6.25,0) 9(8.75,0) 10(11.25,0)
ESOP-8_L4.9-W3.9-P1.27-LS6.0-BL-EP-2
  oval 0.63x1.865 smd: 1(-1.905,-2.683) 2(-0.635,-2.683) 3(0.635,-2.683) 4(1.905,-2.683) 5(1.905,2.683) 6(0.635,2.683) 7(-0.635,2.683) 8(-1.905,2.683)
  rect 3.15x2.26 smd: 9(0,0)
HDR-TH_20P-P2.54-V-F-2
  rect 1.65x1.65 hole 1.02: 1(-24.13,0)
  round 1.65 hole 1.02: 2(-21.59,0) 3(-19.05,0) 4(-16.51,0) 5(-13.97,0) 6(-11.43,0) 7(-8.89,0) 8(-6.35,0) 9(-3.81,0) 10(-1.27,0) 11(1.27,0) 12(3.81,0) 13(6.35,0) 14(8.89,0) 15(11.43,0) 16(13.97,0) 17(16.51,0) 18(19.05,0) 19(21.59,0) 20(24.13,0)
IND-SMD_L7.5-W6.6
  rect 3x3.5 smd: 1(-3.302,0) 2(3.302,0)
IND-SMD_L12.3-W12.3_SMDRI127
  rect 2.9x5.4 smd: 1(-5.25,0) 2(5.25,0)
LED_0805
  rect 1x1.25 smd: 1(-1.15,0.005) 2(1.05,0.005)
R0805
  rect 1.133x1.377 smd: 1(-1,0) 2(1,0)
R1210
  rect 1.282x2.808 smd: 1(-1.441,0) 2(1.441,0)
R2512
  rect 1.282x3.456 smd: 1(-3.067,0) 2(3.067,0)
SMA_L4.2-W2.7-LS5.3-RD
  rect 2.046x1.62 smd: 1(-2.16,0) 2(2.16,0)
SMA_L4.3-W2.6-LS5.1-RD
  rect 2x2 smd: 1(-2.2,0) 2(2.2,0)
SMA_L4.3-W2.6-LS5.2-RD
  rect 2x2 smd: 1(-2.2,0) 2(2.2,0)
SMC_L6.9-W5.9-LS7.9-RD
  rect 2.7x3.3 smd: 1(-3.687,0) 2(3.687,0)
SOD-323_L1.7-W1.3-LS2.6-RD
  rect 0.83x0.63 smd: 1(-1.14,0) 2(1.14,0)
SOP-8_L4.9-W3.9-P1.27-LS6.0-BL
  oval 0.63x1.865 smd: 1(-1.905,-2.683) 2(-0.635,-2.683) 3(0.635,-2.683) 4(1.905,-2.683) 5(1.905,2.683) 6(0.635,2.683) 7(-0.635,2.683) 8(-1.905,2.683)
SOT-23-5_L2.9-W1.6-P0.95-LS2.8-BL
  rect 0.6x1 smd: 1(-0.95,-1.1) 2(0,-1.1) 3(0.95,-1.1) 4(0.95,1.1) 5(-0.95,1.1)
SOT-223-3_L6.5-W3.4-P2.30-LS7.0-BR
  rect 2.5x1.1 smd: 1(2.97,-2.3) 2(2.97,0) 3(2.97,2.3)
  rect 2.34x3.6 smd: 4(-2.97,0)
TEST-TH_BD2.54-P1.4_RED
  round 1.9 hole 1.2: 1(0,0)
TO-252-2_L6.6-W6.1-P4.57-LS9.9-BR-CW
  rect 3x1.6 smd: 1(3.424,-2.29) 3(3.424,2.29)
  rect 6.2x5.8 smd: 2(-3.424,0)
TO-252-2_L6.6-W6.1-P4.57-LS10.1-TL-CW
  rect 3x1.6 smd: 1(-3.424,2.285) 3(-3.424,-2.285)
  rect 6.2x5.8 smd: 2(3.424,0)
固定孔
  round 1 hole 0.5x0.505: 1(-2.032,0) 3(2.032,0)
  round 1 hole 0.505x0.5: 2(0,-2.032) 4(0,2.032)
  round 5 hole 3.205x3.2: 5(0,0)

## Nets
As in the schematic.

Pads without a net: P3 1 2 3 4 5; P4 1 2 3 4 5; P5 1 2 3 4 5; P6 1 2 3 4 5; U9 2 3 5; U12 6 7

## Via types
v1: diameter 0.61, hole 0.305, Top Layer to Bottom Layer, 260 vias

## Routing (per net, layer and track width the routed paths; a pad name or vN(x,y) marks a point on that pad's centre or on a via; arc(x,y) is an arc through that point)
3.3V: length 141
  Top Layer w0.254: U3.1 65.79,26.54 69.22,29.97 69.22,36.07 v1(68.33,36.96) ; C56.2 R28.2
  Top Layer w0.508: U1.4 U1.2 50.66,17.28 51.32,16.63 C56.2 59.57,16.63 64.01,12.19 ; 64.01,12.19 U3.1 ; 64.01,12.19 U2.1
  Bottom Layer w0.254: U5.5 64.09,39.58 64.77,40.26 C60.2 66.55,40.07 66.55,38.74 v1(68.33,36.96) ; 20.7,26.92 20.7,29.46 22.59,31.35 C58.2 21.16,38.86 U7.5 ; U4.5 42.14,38.48 43.18,38.48 43.82,39.12 C61.2 44.72,38.85 53.95,29.62 53.95,28.07
  Bottom Layer w0.508: U3.1 62.48,28.07 21.97,28.07 20.83,26.92 U3.18
5V: length 97.7
  Top Layer w0.254: v1(22.61,24.38) 34.42,24.38 34.92,23.88 34.92,22.46 36.19,21.2 U10.3
  Top Layer w0.508: U1.3 48.94,22.04 C55.2 48.62,23.52 48.01,24.13 44.07,24.13 39.5,19.56 U10.3 42.67,13.08 57.79,13.08 58.93,11.94 U2.3
  Bottom Layer w0.254: v1(22.61,24.38) 15.53,17.3 7.8,17.3
  Bottom Layer w0.508: U2.3 60.96,13.34 74.05,13.34 U15.2
12V: length 56.1
  Top Layer w0.508: D6.2 25.65,34.92 24.62,33.89 U8.1 6.1,33.15 3.41,30.46 R24.2 4.79,21.5 8.76,17.53 16.59,17.53 v1(21.17,12.95)
  vias: v1(21.97,13.72) v1(21.97,12.95) v1(22.73,13.21) v1(34.8,16.26) v1(34.8,13.59) v1(35.69,16.26) v1(35.69,13.59) v1(36.63,16.26) v1(36.62,13.59) v1(37.59,16.26) v1(37.59,13.58)
GND:
  vias: v1(1.14,16.64) v1(1.14,15.7) v1(1.14,14.87) v1(2.16,16.62) v1(2.16,15.7) v1(2.16,14.86) v1(6.86,52.71) v1(6.86,51.69) v1(7.87,52.71) v1(7.87,51.69) v1(8.89,52.71) v1(8.89,51.69) v1(8.89,50.67) v1(8.89,49.66) v1(9.91,52.71) v1(9.91,51.69) v1(9.91,50.67) v1(9.91,49.66) v1(10.54,11.68) v1(11.3,10.67) v1(15.49,2.54) v1(15.49,1.52) v1(16.38,22.86) v1(16.38,21.84) v1(16.51,2.54) v1(16.51,1.52) v1(17.4,22.86) v1(17.4,21.84) v1(17.53,2.54) v1(17.53,1.52) v1(17.91,49.15) v1(17.91,48.13) v1(18.54,2.54) v1(18.54,1.52) v1(18.92,49.15) v1(18.92,48.13) v1(22.1,52.71) v1(22.1,51.69) v1(22.23,2.54) v1(22.23,1.52) v1(23.11,52.71) v1(23.11,51.69) v1(23.24,2.54) v1(23.24,1.52) v1(24.26,2.54) v1(24.26,1.52) v1(24.38,52.71) v1(24.38,51.69) v1(25.27,2.54) v1(25.27,1.52) v1(25.4,52.71) v1(25.4,51.69) v1(25.53,16.26) v1(26.29,16.76) v1(27.02,17.27) v1(27.81,17.78) v1(28.07,2.54) v1(28.07,1.52) v1(28.49,38.83) v1(28.49,37.82) v1(28.7,18.42) v1(29.08,2.54) v1(29.08,1.52) v1(29.34,52.71) v1(29.34,51.69) v1(29.46,18.92) v1(29.51,38.83) v1(29.51,37.82) v1(29.59,45.85) v1(29.59,44.83) v1(30.1,2.54) v1(30.1,1.52) v1(30.35,52.71) v1(30.35,51.69) v1(30.61,45.85) v1(30.61,44.83) v1(31.11,2.54) v1(31.11,1.52) v1(31.62,52.71) v1(31.62,51.69) v1(31.62,36.58) v1(32.13,44.58) v1(32.13,43.56) v1(32.64,52.71) v1(32.64,51.69) v1(33.15,44.58) v1(33.15,43.56) v1(34.8,36.58) v1(34.8,35.56) v1(34.8,34.47) v1(36.45,30.48) v1(36.45,29.46) v1(37.47,30.48) v1(37.47,29.46) v1(37.72,22.73) v1(37.72,21.72) v1(38.73,22.73) v1(38.73,21.72) v1(39.37,18.67) v1(39.37,17.65) v1(40.39,18.67) v1(40.39,17.65) v1(40.39,6.73) v1(42.8,52.71) v1(42.8,51.69) v1(42.8,50.55) v1(42.8,49.53) v1(43.82,52.71) v1(43.82,51.69) v1(43.82,50.55) v1(43.82,49.53) v1(45.21,15.49) v1(45.21,14.48) v1(46.23,15.49) v1(46.23,14.48) v1(49.53,2.54) v1(49.53,1.52) v1(50.17,38.74) v1(50.17,37.72) v1(50.42,23.75) v1(50.42,22.73) v1(50.55,2.54) v1(50.55,1.52) v1(51.44,23.75) v1(51.44,22.73) v1(51.56,2.54) v1(51.56,1.52) v1(52.45,23.75) v1(52.45,22.73) v1(52.58,2.54) v1(52.58,1.52) v1(53.47,23.75) v1(53.47,22.73) v1(54.48,23.75) v1(54.48,22.73) v1(55.5,23.75) v1(55.5,22.73) v1(55.88,2.54) v1(55.88,1.52) v1(56.9,2.54) v1(56.9,1.52) v1(57.91,2.54) v1(57.91,1.52) v1(58.93,41.91) v1(58.93,40.89) v1(58.93,2.54) v1(58.93,1.52) v1(59.69,32) v1(59.69,30.99) v1(59.69,29.97) v1(59.69,28.96) v1(59.94,41.91) v1(59.94,40.89) v1(60.71,32) v1(60.71,30.99) v1(60.71,29.97) v1(60.71,28.96) v1(61.68,2.54) v1(61.68,1.52) v1(62.7,2.54) v1(62.7,1.52) v1(63.72,2.54) v1(63.72,1.52) v1(64.73,2.54) v1(64.73,1.52) v1(67.82,11.94) v1(67.82,10.92) v1(68.83,11.94) v1(68.83,10.92) v1(69.85,11.94) v1(69.85,10.92) v1(70.36,35.43) v1(70.36,33.53) v1(70.36,32.51) v1(70.36,31.37) v1(70.36,30.35) v1(70.87,11.94) v1(70.87,10.92) v1(71.37,35.43) v1(71.37,33.53) v1(71.37,32.51) v1(71.37,31.37) v1(71.37,30.35) v1(77.98,33.91) v1(77.98,32.89) v1(77.98,28.83) v1(77.98,27.81) v1(77.98,21.72) v1(77.98,20.7) v1(77.98,15.62) v1(77.98,14.61) v1(77.98,9.02) v1(77.98,8) v1(78.99,33.91) v1(78.99,32.89) v1(78.99,28.83) v1(78.99,27.81) v1(78.99,21.72) v1(78.99,20.7) v1(78.99,15.62) v1(78.99,14.61) v1(78.99,9.02) v1(78.99,8) v1(80.01,33.91) v1(80.01,32.89) v1(80.01,28.83) v1(80.01,27.81) v1(80.01,21.72) v1(80.01,20.7) v1(80.01,15.62) v1(80.01,14.61) v1(80.01,9.02) v1(80.01,8) v1(81.03,33.91) v1(81.03,32.89) v1(81.03,28.83) v1(81.03,27.81) v1(81.03,21.72) v1(81.03,20.7) v1(81.03,15.62) v1(81.03,14.61) v1(81.03,9.02) v1(81.03,8)
VIN: length 70.3
  Top Layer w0.254: R15.2 20.19,51.05 20.19,49.4 19.69,48.9 v1(19.69,46.36)
  Top Layer w0.762: U9.7 3.2,10.79 C53.2
  Bottom Layer w0.254: R12.2 14.08,33.04 12.57,34.54 12.57,39.75 18.29,45.47
  Bottom Layer w0.508: v1(20.52,45.47) v1(19.69,45.47) 16.13,45.47 4.95,34.29 4.95,25.15 3.81,24 3.81,15.24 4.32,14.73 4.32,11.68 3.77,11.13 v1(3.77,9.68)
  vias: v1(2.98,9.68) v1(2.99,8.85) v1(3.85,8.85) v1(20.51,46.36) v1(21.36,46.36) v1(21.35,45.47) v1(22.19,45.47) v1(22.2,46.36)
A: length 90.5
  Top Layer w0.254: U2.4 58.8,8.89 68.07,8.89 68.91,8.05 U14.10
  Bottom Layer w0.254: U14.10 67.08,5.79 11.1,5.79 10.92,5.97 10.92,9.4 5.72,14.61 5.72,18.92 6.1,19.3 7.8,19.3
A0: length 25.8
  Bottom Layer w0.254: U15.7 70.42,20.19 60.2,20.19 U3.5
A1: length 16.8
  Top Layer w0.254: v1(51.31,29.08) U3.6
  Bottom Layer w0.254: v1(51.31,29.08) 51.31,29.85 48.13,33.02 D3.1 44.7,33.02 R5.1 44.69,34.93 42.55,34.93 42.1,35.37 U4.1
A2: length 73
  Top Layer w0.254: v1(65.28,24) 71.88,17.4 71.88,2.92 72.92,1.88 U70.1 ; v1(62.61,24) 56.77,24 56.01,24.77 52.2,24.77 ; 52.2,24.77 49.15,24.77 48.77,25.15 U3.7 ; 52.2,24.77 52.53,25.09 52.53,28.01 52.7,28.19 54.28,28.19 v1(55.75,29.67)
  Bottom Layer w0.254: v1(55.75,29.67) 57.99,29.67 58.8,30.48 58.8,36.92 U5.4 62.69,38.35 63.25,38.35 63.43,38.17 63.43,37.45 U5.1 65.23,37.38 65.91,36.7 65.91,36.15 D2.1 ; v1(65.28,24) v1(62.61,24)
A3: length 39.2
  Top Layer w0.203: v1(21.83,32.26) 22.99,32.26 23.24,32.51 26.04,32.51 26.18,32.37 26.18,28.81 27.18,27.81 44.96,27.81 U3.8
  Bottom Layer w0.254: 19.64,35.05 R13.1 C59.1 ; 19.64,35.05 19.88,34.8 D5.1 21.83,34.79 v1(21.83,32.26) ; 19.64,35.05 U7.1
A4: length 36.3
  Bottom Layer w0.254: U3.9 51.69,18.54 71.27,18.54 U15.6
A5: length 39
  Bottom Layer w0.254: U3.10 50.67,17.02 72.24,17.02 U15.5
A6: length 41.5
  Bottom Layer w0.254: U3.11 49.28,15.88 73.6,15.88 U15.4
A7: length 44.2
  Bottom Layer w0.254: U3.12 48.26,14.35 74.58,14.35 U15.3
A8: length 26.5
  Top Layer w0.254: U2.16 19.39,17.82 19.39,28.41 22.86,31.88 U8.2
A9: length 41.7
  Top Layer w0.254: U8.3 24.57,30.66 22.73,30.66 21.93,29.86 21.93,17.82 U2.15 32,7.75 U13.9 34.91,5.21 39.88,5.21 40.53,4.56 U68.1
A10: length 5.4
  Top Layer w0.254: U13.10 34.54,7.75 U2.14
A11: length 14.4
  Top Layer w0.254: U14.1 37.21,7.62 U2.13
A12: length 14.4
  Top Layer w0.254: U2.12 38.61,8.76 47.77,8.76 U14.2
A15: length 14.3
  Top Layer w0.254: U2.11 40.77,9.14 49.91,9.14 51.41,7.65 U14.3
B: length 93.6
  Top Layer w0.254: U14.9 66.8,7.23 v1(66.8,5.08)
  Bottom Layer w0.254: U14.9 66.41,8.14 64.64,9.91 55.25,9.91 U2.5 ; 7.8,21.3 5.68,21.3 5.33,20.96 5.33,14.35 10.41,9.27 10.41,5.84 11.18,5.08 v1(66.8,5.08)
B0: length 24.7
  Bottom Layer w0.254: U13.4 19.87,8.96 19.56,9.27 19.56,12.32 33.53,26.29 U3.13
B1: length 24.7
  Bottom Layer w0.254: U13.3 17.37,9.17 17.02,9.53 17.02,12.57 U3.14
B3: length 14.3
  Top Layer w0.254: U2.10 42.93,9.53 52,9.53 U14.4
B4: length 14.2
  Top Layer w0.254: U14.5 55.38,7.62 53.12,9.88 45.11,9.88 U2.9
B5: length 14.2
  Bottom Layer w0.254: U14.6 57.77,8.76 48.77,8.76 U2.8
B6: length 14.2
  Bottom Layer w0.254: U2.7 50.93,9.14 59.88,9.14 U14.7
B7: length 94.7
  Top Layer w0.254: v1(63.88,4.19) 63.91,4.22 U14.8
  Bottom Layer w0.254: v1(63.88,4.19) 11.05,4.19 9.65,5.59 9.65,9.27 4.93,14 4.93,22.93 5.11,23.11 7.61,23.11 7.8,23.3 ; U14.8 62,9.53 53.09,9.53 U2.6
B10: length 25.4
  Bottom Layer w0.254: U3.15 13.72,11.81 13.72,9.78 14.87,8.62 U13.2
B11: length 24.4
  Bottom Layer w0.254: U3.16 12.45,13.08 12.45,7.82 U13.1
B12: length 8.1
  Top Layer w0.254: 22.33,7.75 20.94,9.14 19.05,9.14 18.16,10.03 17.02,10.03 U2.20
B13: length 8.1
  Top Layer w0.254: U2.19 19.56,10.03 20.7,10.03 21.59,9.14 23.48,9.14 U13.6
B14: length 8.1
  Top Layer w0.254: U2.18 22.1,10.03 23.24,10.03 24.13,9.14 26.02,9.14 27.41,7.75
B15: length 8.1
  Top Layer w0.254: 29.95,7.75 28.55,9.14 26.67,9.14 25.78,10.03 24.64,10.03 U2.17
C13: length 17.7
  Bottom Layer w0.254: U3.2 61.47,26.04 62.61,24.89 67.62,24.89 U15.10
C14: length 20.1
  Bottom Layer w0.254: U3.3 62.1,23.37 68.59,23.37 U15.9
C15: length 22.8
  Bottom Layer w0.254: U3.4 60.96,21.97 69.7,21.97 U15.8
HO: length 35.3
  Top Layer w0.254: v1(35.43,39.5) 34.91,40.02 R17.2 ; U8.7 v1(28.19,31.88) 28.19,36.45 26.29,38.35 24.64,38.35 24.46,38.53 24.46,40.08 D7.1
  Bottom Layer w0.254: v1(35.43,39.5) 35.43,33.66 33.66,31.88 v1(28.19,31.88) 28.19,33.91 29.31,35.03 U71.1
IN+: length 4.8
  Bottom Layer w0.254: R10.2 20.07,39.8 20.07,40.89 18.67,42.29 v1(17.02,42.29)
LO: length 32.7
  Top Layer w0.254: 39.8,28.45 39.86,28.5 U72.1 ; 39.8,28.45 30.88,28.45 U8.5 ; 39.8,28.45 49.78,28.45 50.04,28.7 50.04,30.46 R18.2 55.88,30.48 56.39,30.99 D8.1
OUT+: length 65.9
  Top Layer w0.254: P7.2 79.38,38.86 80.64,40.13 80.64,44.7 78.99,46.36 74.93,46.36 72.91,48.38 72.91,51.94 ; R20.2 v1(58.67,39.24)
  Bottom Layer w0.254: U4.3 40.24,36.19 C63.1 40.24,32.62 39.62,32 38.23,32 36.58,33.66 36.58,39.24 37.72,40.39 57.53,40.39 v1(58.67,39.24)
  Bottom Layer w1.016: P7.2 77.62,38.08 R30.1
VOUT: length 27.7
  Top Layer w0.254: 66.18,51.94 66.18,48.9
  Bottom Layer w0.254: R2.2 73.66,34.8 75.06,36.2 75.06,42.8 76.2,43.94 76.83,43.94
  Bottom Layer w1.016: 76.83,43.94 77.11,44.21 R30.2
$1N2005: length 11.4
  Bottom Layer w0.254: R1.2 67.09,31.03 C62.1 64.52,31.05 64.52,32.51 64.14,32.89 62.1,32.89 61.54,33.46 R2.1 61.54,37.3 U5.3
$1N2404: length 7
  Bottom Layer w0.254: R5.2 43.7,36.94 43.31,37.34 41.3,37.34 U4.4 40.17,38.47 R3.1
$1N6608: length 5
  Bottom Layer w0.254: R13.2 17.69,32.31 U7.3 17.63,35.04 R12.1
$1N6687: length 5.1
  Bottom Layer w0.254: R11.1 17.91,39.86 R10.1 18.02,38.59 17.65,38.23 17.65,37.33 U7.4
$1N12639: length 24.3
  Top Layer w0.254: Q5.2 39.64,33.66 37.21,33.66 33.8,30.24 C23.1 32.15,30.61 U8.6 ; 40.64,39.75 37.97,39.75 36.45,38.23 32.64,38.23 31.62,39.24 R16.1
$1N13184: length 6
  Top Layer w0.254: D6.1 29.97,33.16 U8.8 31.61,33.15 C23.2
$1N13307: length 9.1
  Top Layer w0.254: Q4.1 36.56,42.02 R17.1 R16.2 31.61,42.04 29.59,42.04 28.96,41.4 D7.2
$1N13478: length 16.4
  Top Layer w0.254: D8.2 54.99,37.34 ; R19.2 R18.1 48.05,30.51 Q5.1 48.01,32.96 48.01,34.16 48.72,34.87 53.92,34.87 54.61,35.56 54.61,36.96 54.99,37.34
$1N14214: length 2.7
  Top Layer w0.254: R21.1 68.18,51.67 68.2,51.69 70.57,51.69 LED2.2
$1N14615: length 3.6
  Top Layer w0.254: C54.2 6.6,16.66 6.6,17.91 6.04,18.47 U9.1
$1N15322: length 2.8
  Top Layer w0.254: LED1.2 15.3,51.16 R15.1
$1N15362: length 6.6
  Top Layer w0.254: R25.2 1.41,24.58 R24.1 1.41,20.2 0.66,19.45 U9.4
$1N15623: length 2.7
  Top Layer w0.254: R26.1 12.57,29.05 12.45,29.18
$1N15689: length 2.8
  Top Layer w0.254: LED4.2 32.91,22.48 33.04,22.61
$1N15785: length 3.3
  Top Layer w0.254: R28.1 55.59,21.07 LED5.2

## Copper pours and planes (outline as drawn; the poured copper is in the pictures)
12V on Top Layer: 2.67,20.83 2.67,24.89 3.68,25.91 8.13,25.91 8.51,25.53 13.34,25.53 13.72,25.15 13.72,23.24 14.1,22.86 14.1,19.43 13.84,19.18 10.29,19.18 10.03,19.43 10.03,22.81 9.34,23.51 5.1,23.51 4.45,22.86 4.45,20.96 4.32,20.83
12V on Top Layer: 34.15,16.62 37.86,16.62 38.35,16.13 38.35,13.34 38.23,13.21 34.15,13.21 34.15,16.62
12V on Top Layer: 22.61,14.1 23.62,13.08 23.62,12.45 20.7,12.45 20.7,13.71 21.08,14.1
12V on Bottom Layer: 34.29,16.64 37.85,16.64 38.35,16.13 38.35,13.22 34.16,13.22 33.78,12.84 33.78,12.7 20.7,12.7 20.57,12.83 21.97,14.22 25.91,14.22 26.29,13.84 32.64,13.84 34.15,15.35 34.15,15.97 34.29,16.11
GND on Top Layer: 0.64,54.32 83.56,54.45 83.56,0.51 0.64,0.51
GND on Bottom Layer: 0,53.94 82.92,53.94 82.92,0 0,0
VIN on Top Layer: 2.54,11.68 4.42,11.68 4.42,8.42 4.13,8.13 2.53,8.13 2.53,11.67
VIN on Top Layer: 26.94,50.47 41.88,50.47 41.88,47.59 27.09,47.59 26.92,47.75 26.92,50.46
VIN on Top Layer: 18.67,43.94 18.67,46.1 21.97,49.4 29.34,49.4 29.46,49.28 29.46,47.5 28.96,46.99 22.99,46.99 22.73,46.74 22.73,44.2 22.48,43.94
VIN on Bottom Layer: 2.54,11.68 4.42,11.68 4.42,8.42 4.13,8.13 2.53,8.13 2.53,11.67
VIN on Bottom Layer: 19.05,46.99 22.23,46.99 22.73,46.48 22.73,44.32 22.61,44.2 18.85,44.2 18.85,46.79
IN+ on Top Layer: 12.57,42.8 22.35,42.8 22.86,42.29 22.86,40.89 20.19,38.23 12.57,38.23
OUT+ on Top Layer: 60.96,45.85 63.25,45.85 64.01,45.09 64.01,42.67 63.37,42.04 63.37,36.96 63.25,36.83 60.96,36.83 60.58,37.21 60.58,45.47
OUT+ on Top Layer: 61.21,46.1 69.47,46.1 69.85,45.72 69.85,41.4 71.12,40.13 78.11,40.13 78.87,39.37 78.87,37.44 78.39,36.96 69.85,36.96 67.06,39.75 67.06,42.93 61.52,42.93 61.19,43.26 61.19,46.08
VOUT on Top Layer: 61.21,49.4 70.74,49.4 73.72,45.47 78.11,45.47 78.87,44.7 78.87,42.55 78.49,42.16 71.63,42.16 70.99,42.8 70.99,45.21 69.85,46.36 67.56,46.36 66.8,47.12 61.6,47.12 61.21,47.5
VOUT on Top Layer: 48.12,53.51 62.32,53.51 64.01,51.82 64.01,47.24 62.1,47.24 61.21,48.13 61.21,50.42 48.39,50.42 48.12,50.68
$1N156 on Top Layer: 4.45,42.55 8.33,42.55 11.38,45.6 16.75,45.6 17.28,46.13 17.28,49.14 11.04,49.14 7.24,45.34 4.45,45.34
$1N12639 on Top Layer: 40.13,43.69 42.8,43.69 43.56,42.93 53.98,42.93 54.36,42.55 54.36,39.88 53.85,39.37 40.64,39.37 39.88,40.13 39.88,43.43
$1N12639 on Top Layer: 51.69,40.64 53.72,40.64 53.72,36.2 53.59,36.07 51.82,36.07 51.69,36.2
$1N12639 on Top Layer: 39.88,41.66 39.88,37.34 40.89,36.32 42.67,36.32 42.93,36.58 42.93,41.53 42.8,41.66
$1N14616 on Top Layer: 4.23,14.27 5.14,14.27 5.14,15.35 5.45,15.66 9.18,15.66 9.65,16.13 13.84,16.13 14.1,15.88 14.1,12.95 13.84,12.7 9.1,12.7 8.41,12.34 8.41,10.63 8.1,10.32 6.08,10.32 4.03,12.38 4.03,14.06

Small or netless copper shapes (teardrops, artwork), in the pictures only: 43 on Bottom Layer

## Text on the board
Bottom Silkscreen Layer: 输入电流采样 | 输出电流采样 | 输出电压采样
Top Silkscreen Layer: C13 | C14 | C15 | A0 | A4 | A5 | A6 | A7 | 5V | B11 | B10 | B1 | B0 | B12 | B13 | B14 | B15 | A9 | A10 | A11 | A12 | A15 | B3 | B4 | B5 | B6 | B7 | B | A | 3.3V | 12V-5V | 5V-3.3V | + | 24V-12V | 驱动
